# Altium schematic sheet RGB_Display.SchDoc
size A3; PageSetup: Record=PageOptions|CenterHorizontal=True|CenterVertical=True|PrintScale=0.73|XCorrection=1.00|YCorrection=1.00|PrintKind=0|BorderSize=5000000|LeftOffset=0|BottomOffset=0|Orientation=2|PaperLength=1000|PaperWidth=1000|Scale=100|PaperSource=7|PrintQuality=-4|MediaType=1|DitherType=10|PaperKind=A4|PrintScaleMode=1; Date: 27.05.2014; DrawnBy: luths8; Organization: BFH; Address1: Bern University of Applied Sciences; Address2: Engineering and Information Technology; Address3: Jlcoweg 1; Address4: CH-3400 Burgdorf; DocumentNumber: 9; Revision: 1.0; SheetNumber: 9; SheetTotal: 16; CurrentDate: 27.05.2014
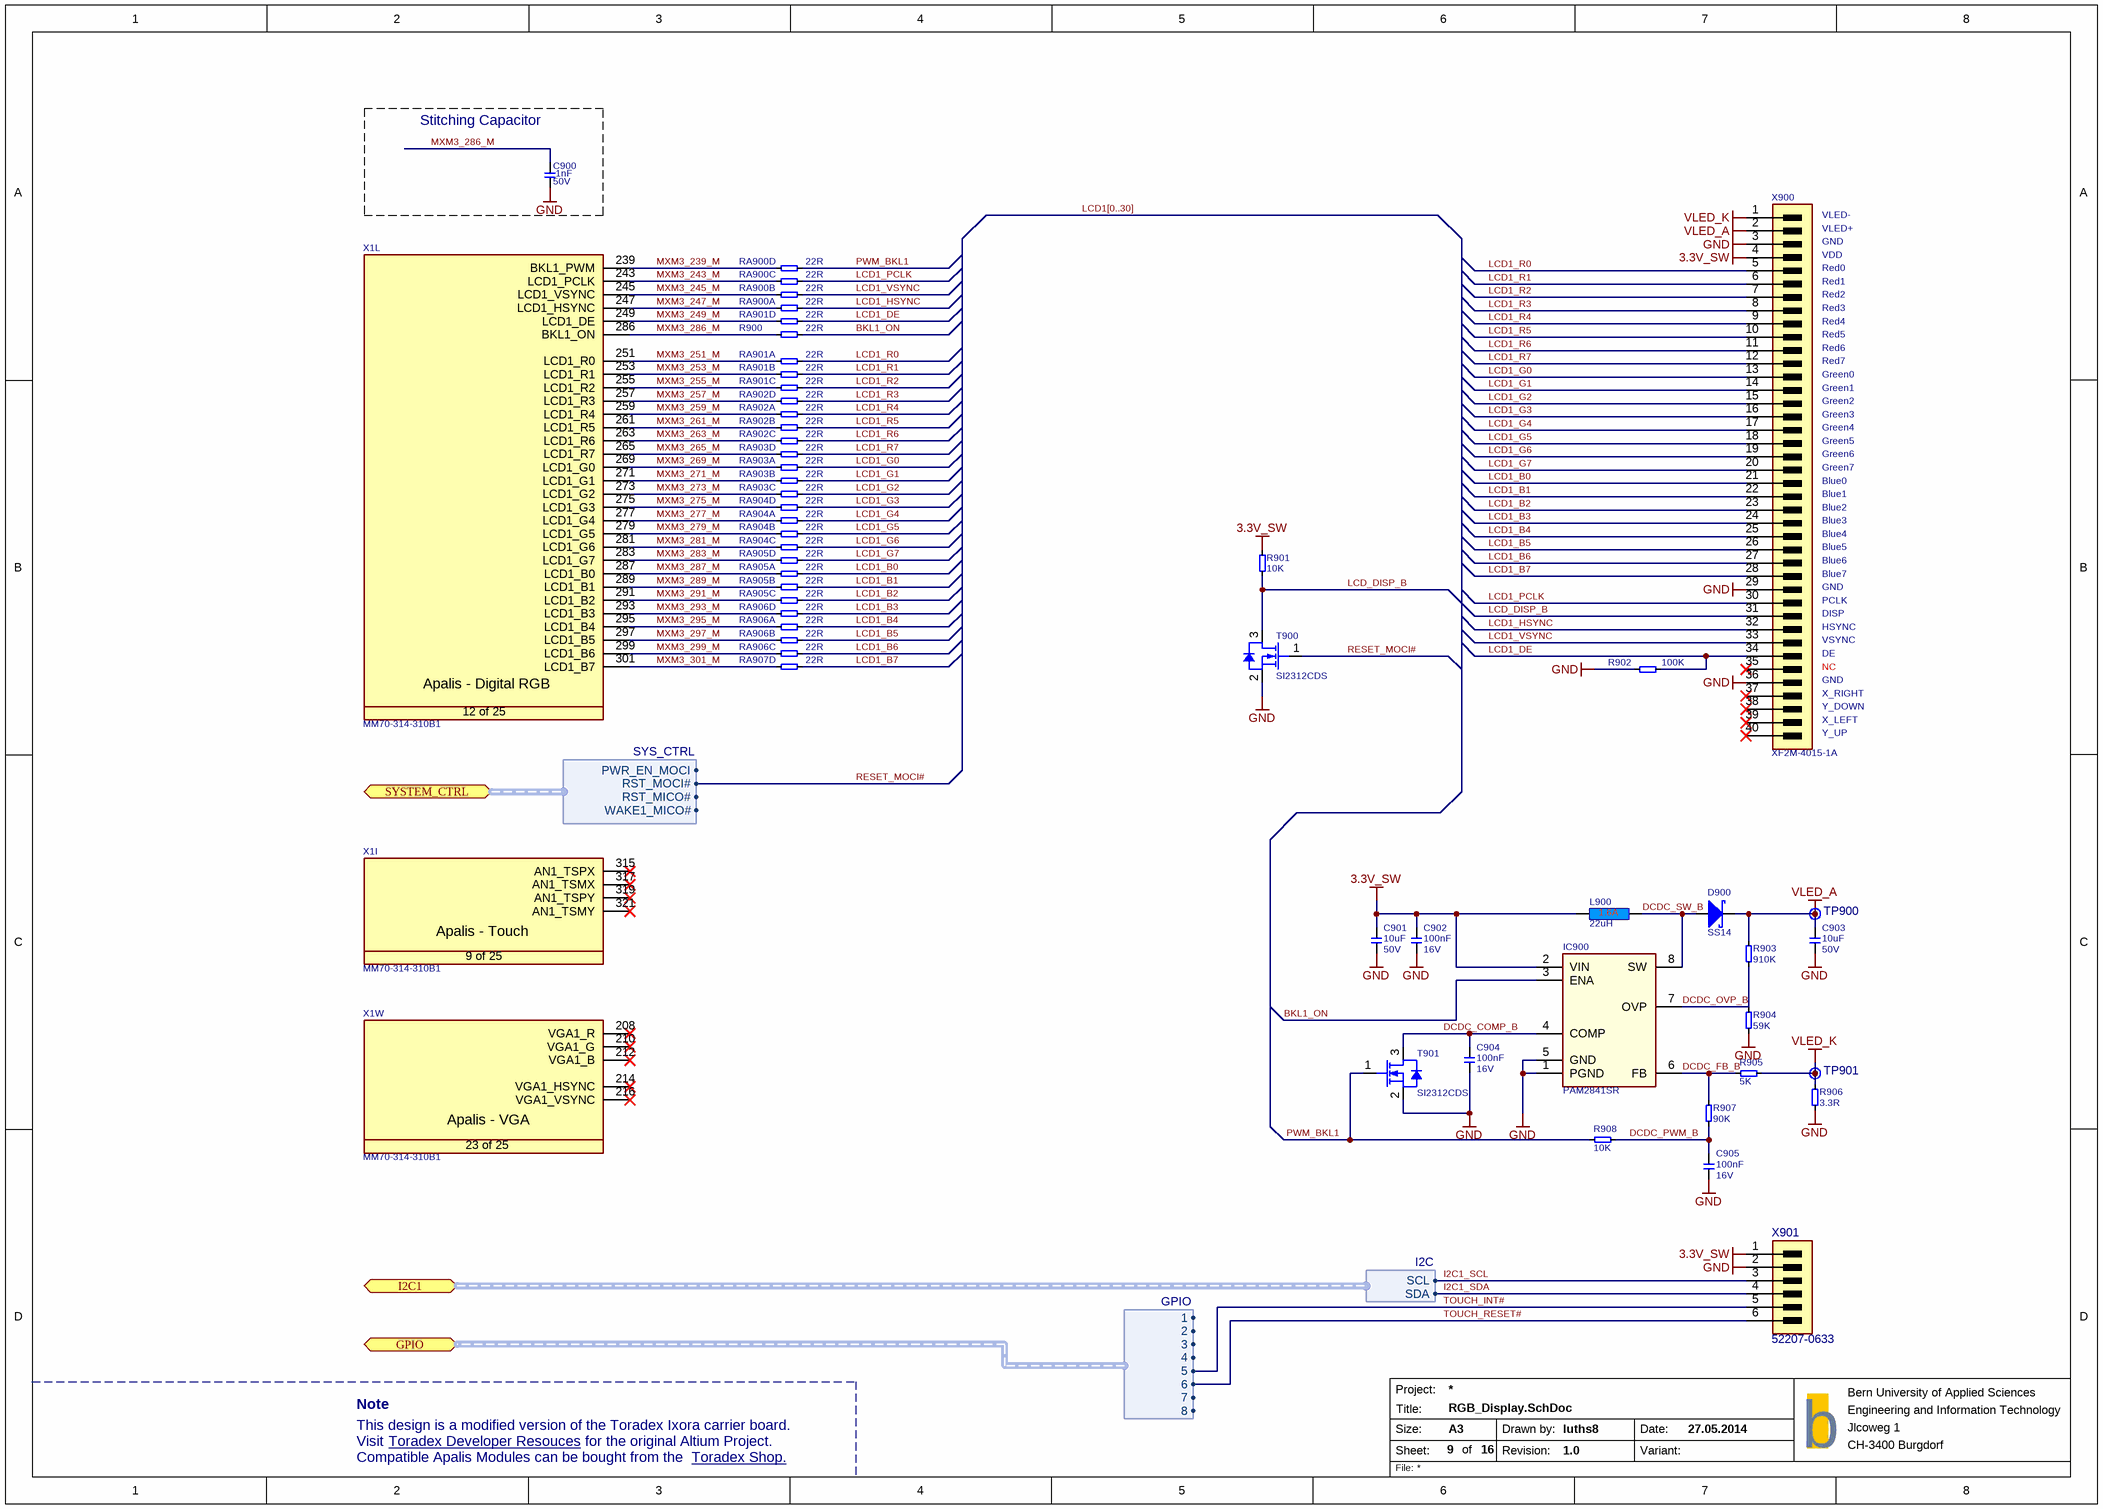
[diagram p0: RGB_Display.SchDoc]

## Parts
C900  Rating: 50V  [SMD0603CAP]  (hidden comment: 1nF)
C901  Rating: 50V  [SMD1210CAP]  (hidden comment: 10uF)
C902  Rating: 16V  [SMD0603CAP]  (hidden comment: 100nF)
C903  Rating: 50V  [SMD1210CAP]  (hidden comment: 10uF)
C904  value 100nF  Rating: 16V  [SMD0603CAP]  (hidden comment: 100nF 16V)
C905  value 100nF  Rating: 16V  [SMD0603CAP]  (hidden comment: 100nF 16V)
D900  SS14  [T_DO-214-AC]
IC900  PAM2841SR  [T_TSOP65P490X110-8N]
L900  22uH  [T_INDM5050]
R900  22R  [SMD0603RES]
R901  10K  [SMD0603RES]
R902  100K  [SMD0603RES]
R903  910K  [SMD0603RES]
R904  59K  [SMD0603RES]
R905  5K  [SMD0603RES]
R906  3.3R  [SMD0603RES]
R907  90K  [SMD0603RES]
R908  10K  [SMD0603RES]
RA900  22R  [T_Resistor_Array_X4]  (parts A,B,C,D of 4)
RA901  22R  [T_Resistor_Array_X4]  (parts A,B,C,D of 4)
RA902  22R  [T_Resistor_Array_X4]  (parts A,B,C,D of 4)
RA903  22R  [T_Resistor_Array_X4]  (parts A,B,C,D of 4)
RA904  22R  [T_Resistor_Array_X4]  (parts A,B,C,D of 4)
RA905  22R  [T_Resistor_Array_X4]  (parts A,B,C,D of 4)
RA906  22R  [T_Resistor_Array_X4]  (parts A,B,C,D of 4)
RA907  22R  [T_Resistor_Array_X4]  (part D of 4)
T900  SI2312CDS  [T_SOT95P230X110-3N]
T901  SI2312CDS  [T_SOT95P230X110-3N]
TP900  Testpoint  [TP]  (value not drawn)  (no BOM)
TP901  Testpoint  [TP]  (value not drawn)  (no BOM)
X1  Manufacturer Part No.: MM70-314-310B1  [T_JAE_MM70-314-310B1]  (hidden comment: CON-JAE-MM70-314-310B1-314-0.5mm)  (parts I,L,W of 25)
X900  XF2M-4015-1A  [T_Omron_XF2M-4015-1A-MIRROR]
X901  52207-0633  [T_MOLEX_52207-0633]

## Blocks framed on the sheet
Stitching Capacitor: C900

## Ports
GPIO (bidir, harness GPIO, see 11, 19, 4), I2C1 (bidir, harness I2C, see 17, 18, 19, 5), SYSTEM_CTRL (bidir, harness SYS_CTRL, see 18, 19, 4)

## Harnesses
I2C: SCL, SDA
SYS_CTRL: PWR_EN_MOCI, RST_MOCI#, RST_MICO#, WAKE1_MICO#
GPIO: 1, 2, 3, 4, 5, 6, 7, 8

## Nets
3.3V_SW: C901.2 C902.1 IC900.2(VIN) L900.1 R901.2 X900.4(VCC) X901.1
GND: C900.1 C901.1 C902.2 C903.1 C904.1 C905.1 IC900.1(PGND) IC900.5(GND) R902.1 R904.1 R906.1 T900.2(S) T901.2(S) X900.3(VCC) X900.29(VSS) X900.36(VDD) X901.2
VLED_A: C903.2 D900.1 R903.2 TP900.1 X900.2(VSS)
VLED_K: R905.2 R906.2 TP901.1 X900.1(VSS)
BKL1_ON: IC900.3(ENA) R900.2
DCDC_COMP_B: C904.2 IC900.4(COMP) T901.3(D)
DCDC_FB_B: IC900.6(FB) R905.1 R907.2
DCDC_OVP_B: IC900.7(OVP) R903.1 R904.2
DCDC_PWM_B: C905.2 R907.1 R908.2
DCDC_SW_B: D900.2 IC900.8(SW) L900.2
I2C1_SCL: X901.3 ; port I2C1.SCL
I2C1_SDA: X901.4 ; port I2C1.SDA
LCD1_B0: RA905.7 X900.21(VSS)
LCD1_B1: RA905.6 X900.22(R5)
LCD1_B2: RA905.5 X900.23(R4)
LCD1_B3: RA906.8 X900.24(R3)
LCD1_B4: RA906.7 X900.25(R2)
LCD1_B5: RA906.6 X900.26(R1)
LCD1_B6: RA906.5 X900.27(R0)
LCD1_B7: RA907.8 X900.28(DCLK)
LCD1_DE: R902.2 RA901.8 X900.34(SHUT)
LCD1_G0: RA903.7 X900.13(B0)
LCD1_G1: RA903.6 X900.14(VSS)
LCD1_G2: RA903.5 X900.15(G5)
LCD1_G3: RA904.8 X900.16(G4)
LCD1_G4: RA904.7 X900.17(G3)
LCD1_G5: RA904.6 X900.18(G2)
LCD1_G6: RA904.5 X900.19(G1)
LCD1_G7: RA905.8 X900.20(G0)
LCD1_HSYNC: RA900.5 X900.32(ENB)
LCD1_PCLK: RA900.7 X900.30(HSYNC)
LCD1_R0: RA901.7 X900.5(PWCTRL)
LCD1_R1: RA901.6 X900.6(LEDCTRL)
LCD1_R2: RA901.5 X900.7(RESET#)
LCD1_R3: RA902.8 X900.8(B5)
LCD1_R4: RA902.7 X900.9(B4)
LCD1_R5: RA902.6 X900.10(B3)
LCD1_R6: RA902.5 X900.11(B2)
LCD1_R7: RA903.8 X900.12(B1)
LCD1_VSYNC: RA900.6 X900.33(NC)
LCD_DISP_B: R901.1 T900.3(D) X900.31(VSYNC)
MXM3_239_M: RA900.4 X1.239(BKL1_PWM)
MXM3_243_M: RA900.3 X1.243(LCD1_PCLK)
MXM3_245_M: RA900.2 X1.245(LCD1_VSYNC)
MXM3_247_M: RA900.1 X1.247(LCD1_HSYNC)
MXM3_249_M: RA901.4 X1.249(LCD1_DE)
MXM3_251_M: RA901.3 X1.251(LCD1_R0)
MXM3_253_M: RA901.2 X1.253(LCD1_R1)
MXM3_255_M: RA901.1 X1.255(LCD1_R2)
MXM3_257_M: RA902.4 X1.257(LCD1_R3)
MXM3_259_M: RA902.3 X1.259(LCD1_R4)
MXM3_261_M: RA902.2 X1.261(LCD1_R5)
MXM3_263_M: RA902.1 X1.263(LCD1_R6)
MXM3_265_M: RA903.4 X1.265(LCD1_R7)
MXM3_269_M: RA903.3 X1.269(LCD1_G0)
MXM3_271_M: RA903.2 X1.271(LCD1_G1)
MXM3_273_M: RA903.1 X1.273(LCD1_G2)
MXM3_275_M: RA904.4 X1.275(LCD1_G3)
MXM3_277_M: RA904.3 X1.277(LCD1_G4)
MXM3_279_M: RA904.2 X1.279(LCD1_G5)
MXM3_281_M: RA904.1 X1.281(LCD1_G6)
MXM3_283_M: RA905.4 X1.283(LCD1_G7)
MXM3_286_M: C900.2 R900.1 X1.286(BKL1_ON)
MXM3_287_M: RA905.3 X1.287(LCD1_B0)
MXM3_289_M: RA905.2 X1.289(LCD1_B1)
MXM3_291_M: RA905.1 X1.291(LCD1_B2)
MXM3_293_M: RA906.4 X1.293(LCD1_B3)
MXM3_295_M: RA906.3 X1.295(LCD1_B4)
MXM3_297_M: RA906.2 X1.297(LCD1_B5)
MXM3_299_M: RA906.1 X1.299(LCD1_B6)
MXM3_301_M: RA907.4 X1.301(LCD1_B7)
PWM_BKL1: R908.1 RA900.8 T901.1(G)
RESET_MOCI#: T900.1(G) ; port SYSTEM_CTRL.RST_MOCI#
TOUCH_INT#: X901.5 ; port GPIO.5
TOUCH_RESET#: X901.6 ; port GPIO.6

Not connected (* = marked no-connect by the designer): X1 208(VGA1_R)* 210(VGA1_G)* 212(VGA1_B)* 214(VGA1_HSYNC)* 216(VGA1_VSYNC)* 315(AN1_TSPX)* 317(AN1_TSMX)* 319(AN1_TSPY)* 321(AN1_TSMY)*; X900 35(VSS)* 37(YU)* 38(XR)* 39(YD)* 40(XL)*

## Buses and harness runs
bus LCD1[0..30]

## Notes on the sheet
- (near X900) VLED-
- (near X900) VLED+
- (near X900) GND
- (near X900) Red0
- (near X900) Red1
- (near X900) Red2
- (near X900) Red3
- (near X900) VDD
- (near X900) Green0
- (near X900) Red4
- (near X900) Red5
- (near X900) Red6
- (near X900) Red7
- (near X900) Green1
- (near X900) Green2
- (near X900) Green3
- (near X900) Green4
- (near X900) Green5
- (near X900) Blue0
- (near X900) Blue1
- (near X900) Blue2
- (near X900) Green6
- (near X900) Green7
- (near X900) Blue3
- (near X900) Blue4
- (near X900) Blue5
- (near X900) Blue6
- (near X900) Blue7
- (near X900) PCLK
- (near X900) DISP
- (near X900) HSYNC
- (near X900) VSYNC
- (near X900) DE
- (near X900) NC
- (near X900) X_RIGHT
- (near X900) Y_DOWN
- (near X900) X_LEFT
- (near X900) Y_UP
- Note
- This design is a modified version of the Toradex Ixora carrier board.
- Visit
- Compatible Apalis Modules can be bought from the
- Toradex Developer Resouces <https://developer.toradex.com/products/ixora-carrier-board>
- for the original Altium Project.
- Toradex Shop. <https://www.toradex.com/order-now/apalis-arm-family>
- Project:
- Size:
- Sheet:
- Title:
- A3
- of
- Drawn by:
- Revision:
- Date:
- Variant:
- b
- File:
- (in symbol CON-JAE-MM70-314-310B1-314-0.5mm, part I) Apalis - Touch; 9 of 25
- (in symbol CON-JAE-MM70-314-310B1-314-0.5mm, part L) Apalis - Digital RGB; 12 of 25
- (in symbol CON-JAE-MM70-314-310B1-314-0.5mm, part W) Apalis - VGA; 23 of 25

## Library data of the parts
C900 = C-X7R-1nF-50V-10%-0402: Capacitor Ceramic X7R 1nF 50V 10% 0603; Tolerance: 10%; Type: X7R; Value: 1nF
C901 C903 = C-X5R-10uF-50V-10%-1210: Capacitor Ceramic X5R 10uF 50V 10% 1210; Manufacturer: Generic; Tolerance: 10%; Type: X5R; Manufacturer Part Number: *; Value: 10uF
C902 = C-X7R-100nF-16V-10%-0603: Capacitor Ceramic X7R 100nF 16V 10% 0603; Manufacturer: Generic; Tolerance: 10%; Type: X7R; Manufacturer Part Number: *; Value: 100nF
C904 C905 = C-X7R-100nF-16V-10%-0603: Capacitor Ceramic X7R 100nF 16V 10% 0603; Tolerance: 10%; Type: X7R
D900 = D-Fairchild-SS14: Schottky Diode 40V 1A; Manufacturer Name: Fairdhild; Manufacturer Part No.: SS14
IC900 = IC-DiodesInc-PAM2841GR: Diodes Inc, PAM2841GR, DC/DC step-up LED driver; Manufacturer: Diodes Incorporated; Manufacturer Part No.: PAM2841GR; Package: DFN2x2-8
L900 = L-Bourns-SRN5040-220M: Inductor shielded 22uH 1.6A; Manufacturer: Generic; Tolerance: 25%; Rating: 1.6A; Manufacturer Part Number: *; Value: 22uH
R900 = R-22R-63mW-5%-0402: Resistor 22 ohm 63mW 5% 0603; Rating: 63mW; Tolerance: 5%; Value: 22R
R901 R908 = R-10KR-63mW-1%-0603: Resistor 10 Kohm 63mW 1% 0603; Manufacturer: Generic; Rating: 63mW; Tolerance: 1%; Value: 10K; Manufacturer Part Number: *
R902 = R-100KR-63mW-5%-0603: Resistor 100 Kohm 63mW 5% 0603; Manufacturer: Generic; Value: 100KR; Rating: 63mW; Tolerance: 5%; Manufacturer Part Number: *
R903 = R-910KR-63mW-1%-0603: Resistor 910 Kohm 63mW 1% 0603; Manufacturer: Generic; Value: 910KR; Rating: 63mW; Tolerance: 1%; Manufacturer Part Number: *
R904 = R-59KR-63mW-1%-0603: Resistor 59 Kohm 63mW 1% 0603; Manufacturer: Generic; Value: 49KR; Rating: 63mW; Tolerance: 1%; Manufacturer Part Number: *
R905 = R-5KR-63mW-1%-0603: Resistor 5 Kohm 63mW 1% 0603; Manufacturer: Generic; Rating: 63mW; Tolerance: 1%; Value: 5K; Manufacturer Part Number: *
R906 = R-3.3R-63mW-1%-0603: Resistor 3.3 ohm 63mW 1% 0603; Manufacturer: Generic; Rating: 63mW; Tolerance: 1%; Manufacturer Part Number: *; Value: 3.3R
R907 = R-90KR-63mW-1%-0603: Resistor 90 Kohm 63mW 1% 0603; Manufacturer: Generic; Rating: 63mW; Tolerance: 1%; Value: 90K; Manufacturer Part Number: *
RA900-RA907 = RA-22R-63mW-5%-1206-div: Resistor Array 22 R 63mW 5% 1206; Tolerance: 5%; Power Dissipation: 63mW; Value: 22R
T900 T901 = T-Vishay-SI2312CDS: N-Channel 20V (D-S)  MOSFET; Manufacturer: Vishay; Manufacturer Part No.: SI2312CDS
X1 = CON-JAE-MM70-314-310B1-314-0.5mm: MXM3 Connector; Manufacturer Name: JAE; No. of ways: 314
X900 = CON-Omron-XF2M-4015-1A-40-0.5mm: RGB Connector; Manufacturer Name: Omron; No. of ways: 40; Pitch: 0.5mm; Manufacturer Part No.: XF2M-4015-1A; System: Connector
X901 = CON-Molex-52207-0633: 1mm Pitch FFC/FPC Connector; Manufacturer Name: Molex; No. of ways: 8; Pitch: 0.5mm; Manufacturer Part No.: 52207-0633; System: Connector